# EAGLE design schem (EAGLE 6.5.0)
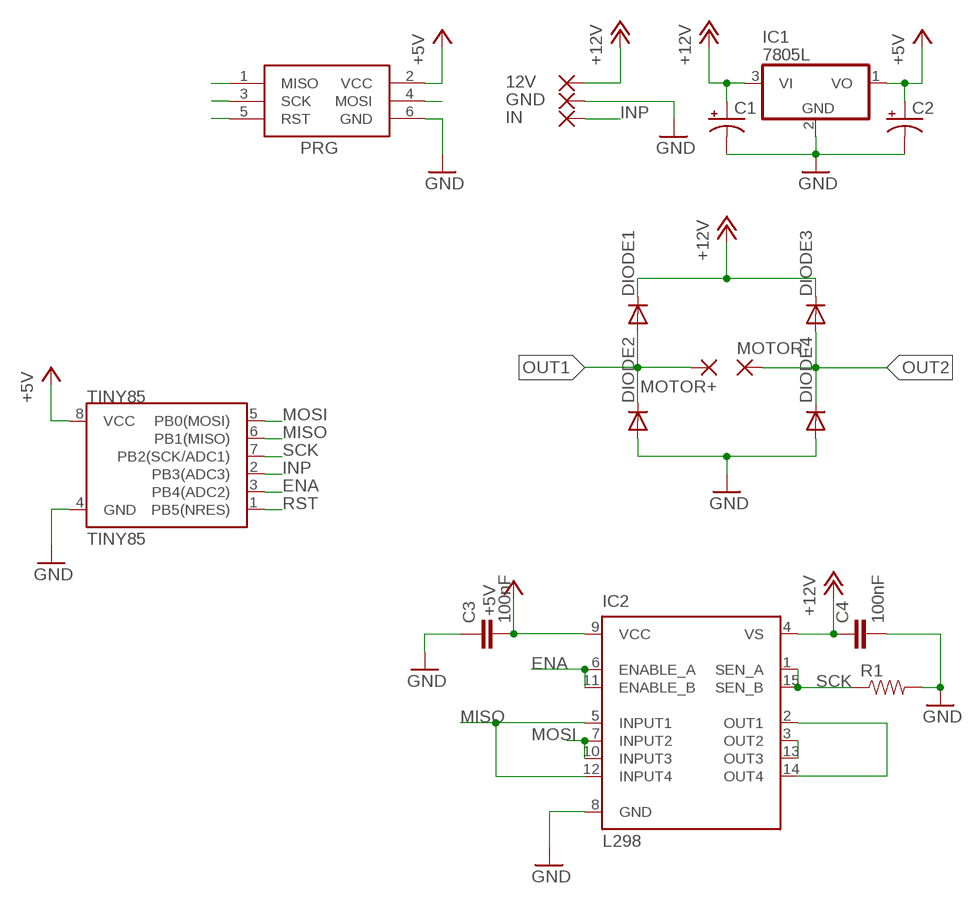
[diagram p0: schematic, sheet 1]

## Parts
12V  3,81/1,4  [3,81/1,4]
C1  CPOL-USE2.5-6  [E2,5-6]
C2  CPOL-USE2.5-6  [E2,5-6]
C3  100nF  CAPPTH2  [CAP-PTH-SMALL2]
C4  100nF  CAPPTH2  [CAP-PTH-SMALL2]
DIODE1  DIODE-DO41-7.6  [DO41-7.6]
DIODE2  DIODE-DO41-7.6  [DO41-7.6]
DIODE3  DIODE-DO41-7.6  [DO41-7.6]
DIODE4  DIODE-DO41-7.6  [DO41-7.6]
GND  3,81/1,4  [3,81/1,4]
IC1  7805L  [TO92]
IC2  L298  [MULTIWATT-15]
IN  1,6/0,9  [1,6/0,9]
MOTOR+  3,81/1,4  [3,81/1,4]
MOTOR-  3,81/1,4  [3,81/1,4]
PRG  AVRISP-6  [AVRISP]
R1  RESISTORPTH-1/4W  [AXIAL-0.4]
TINY85  TINY85  ATTINY45TINY85-20-DIP  [DIP08]

## Nets
+5V: C2.+ C3.2 IC1.1(VO) IC2.9(VCC) PRG.2(VCC) TINY85.8(VCC)
+12V: 12V.1(P) C1.+ C4.1 DIODE1.C DIODE3.C IC1.3(VI) IC2.4(VS)
ENA: IC2.6(ENABLE_A) IC2.11(ENABLE_B) TINY85.3(PB4(ADC2))
GND: C1.- C2.- C3.1 C4.2 DIODE2.A DIODE4.A GND.1(P) IC1.2(GND) IC2.8(GND) PRG.6(GND) R1.P$2 TINY85.4(GND)
INP: IN.1(P) TINY85.2(PB3(ADC3))
MISO: IC2.5(INPUT1) IC2.12(INPUT4) PRG.1(MISO) TINY85.6(PB1(MISO))
MOSI: IC2.7(INPUT2) IC2.10(INPUT3) PRG.4(MOSI) TINY85.5(PB0(MOSI))
OUT1: DIODE1.A DIODE2.C IC2.2(OUT1) IC2.14(OUT4) MOTOR+.1(P)
OUT2: DIODE3.A DIODE4.C IC2.3(OUT2) IC2.13(OUT3) MOTOR-.1(P)
RST: PRG.5(RST) TINY85.1(PB5(NRES))
SCK: IC2.1(SEN_A) IC2.15(SEN_B) PRG.3(SCK) R1.P$1 TINY85.7(PB2(SCK/ADC1))

## Library data of the parts
12V GND MOTOR+ MOTOR- = wirepad:3,81/1,4: THROUGH-HOLE PAD
C1 C2 = adafruit:CPOL-US: POLARIZED CAPACITOR, American symbol
C3 C4 = SparkFun-Capacitors:CAP: Capacitor Standard 0603 ceramic capacitor, and 0.1" leaded capacitor.
DIODE1-DIODE4 = diode:DIODE-: DIODE
IC1 = linear:78*: Positive VOLTAGE REGULATOR Source: http://cache.national.com/ds/LM/LM78L05.pdf http://www.fairchildsemi.com/ds/LM/LM7805.pdf
IC2 = st-microelectronics:L298: DUAL FULL-BRIDGE DRIVER; MPN: L298N; OC_FARNELL: 1589425; OC_NEWARK: 32M1527
IN = wirepad:1,6/0,9: THROUGH-HOLE PAD
PRG = adafruit:AVRISP: AVR ISP HEADER Standard 6 pin header for AVR programming
R1 = SparkFun-Passives:RESISTOR: Resistor Basic schematic elements and footprints for 0603, 1206, and PTH resistors.
TINY85 = SparkFun-DigitalIC:ATTINY45: Atmel 8-pin 2/4/8kB flash uC; PROD_ID: IC-09445; VALUE: TINY85-20-DIP

## Board
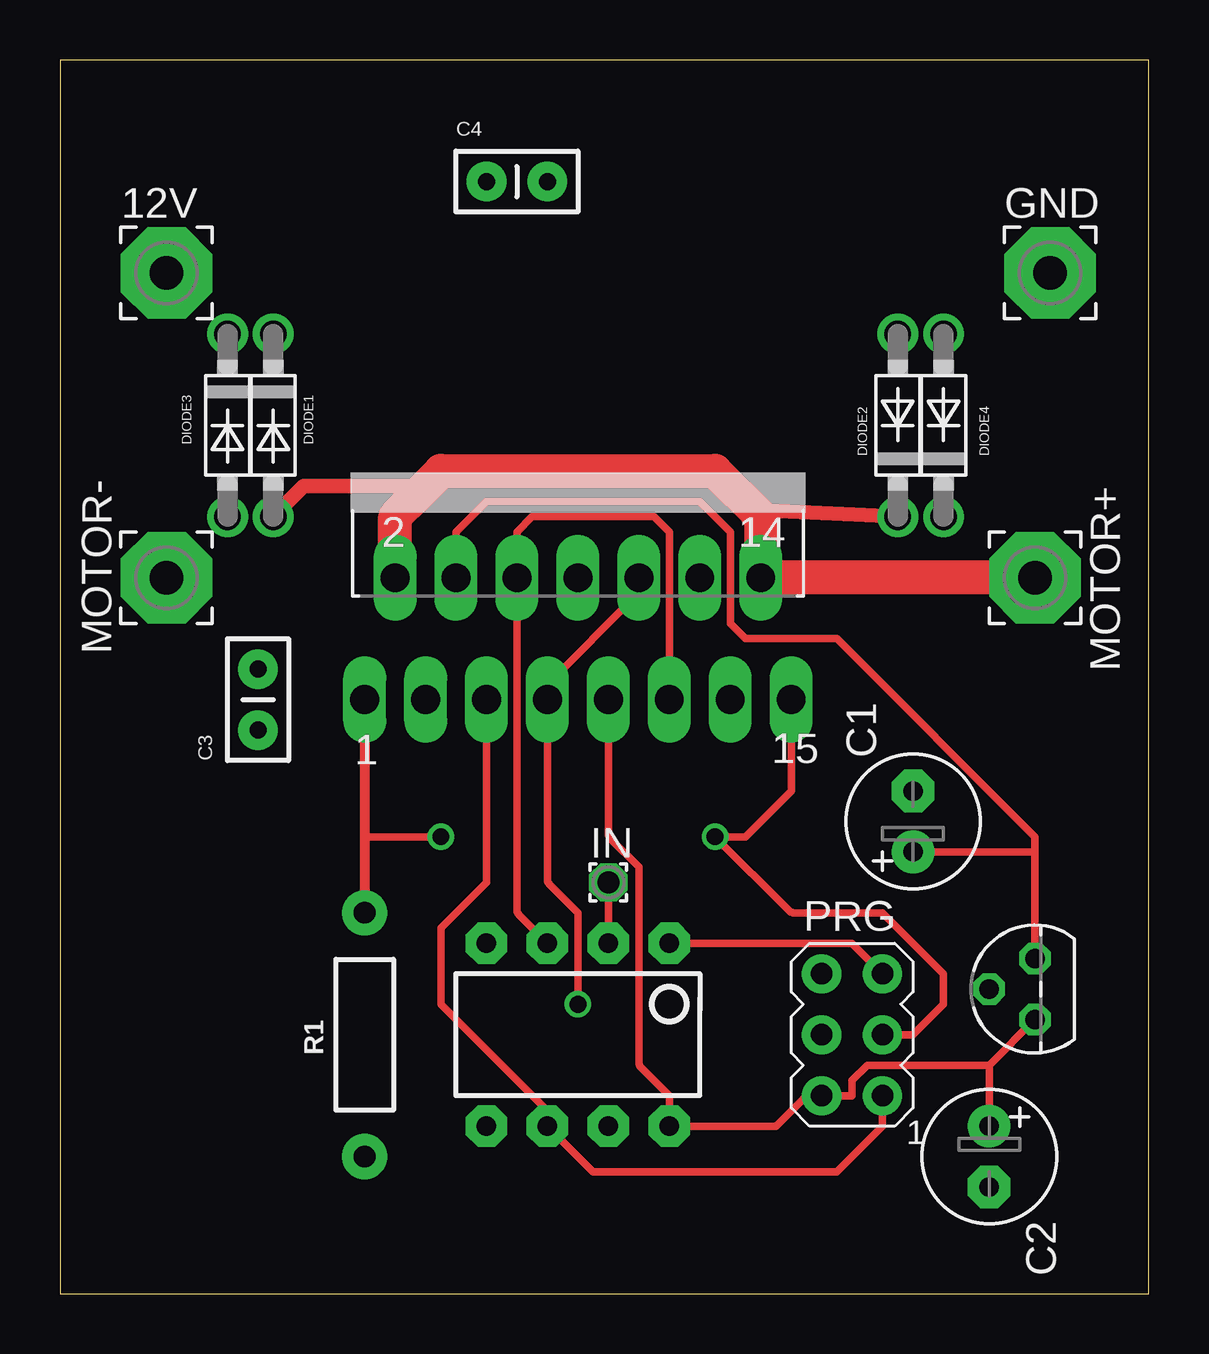
[diagram p1: board, top side]
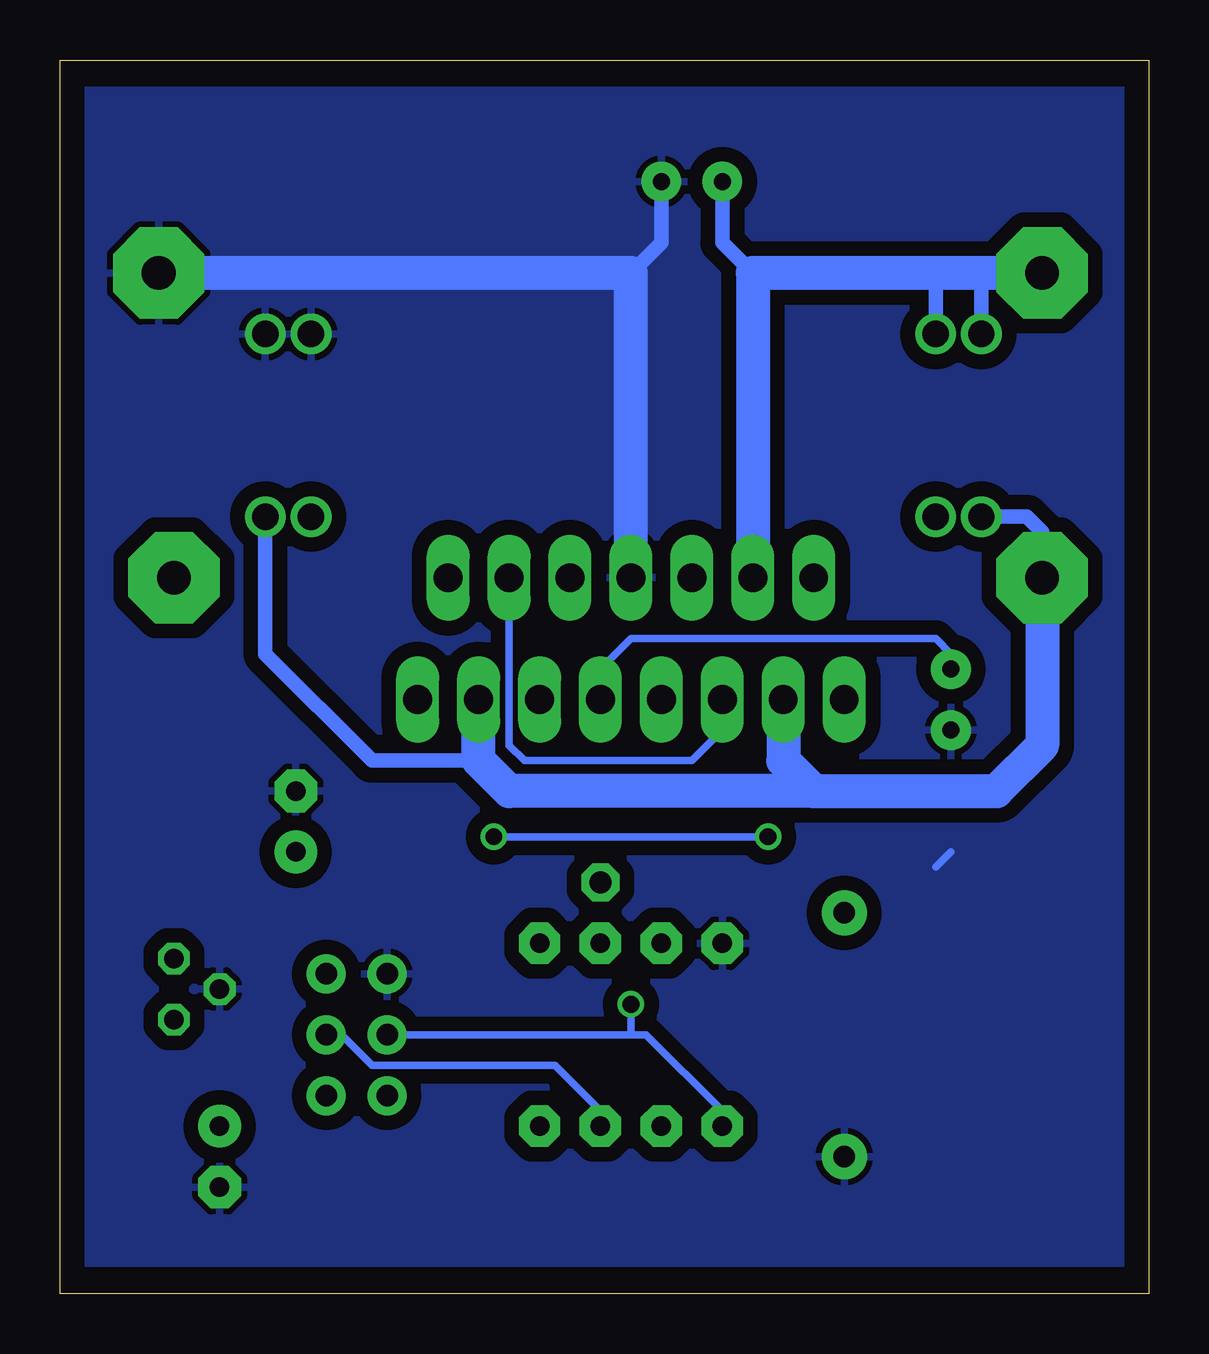
[diagram p2: board, bottom side, seen from below]

Size 45.39 x 51.42 mm. Coordinates in mm from the lower left corner, seen from the top.
Outline: 0,0 45.39,0 45.39,51.42 0,51.42 0,0
Copper layers (1*16): Top 0.035mm / dielectric 1.5mm / Bottom 0.035mm
Design rules "default": minimum track width 10mil, minimum drill 24mil, track to track 8mil, track to pad 8mil, pad to pad 8mil, via to via 8mil, smd to smd 8mil, copper to edge 40mil, drill to drill 8mil, minimum pad ring 10mil, minimum via ring 8mil, stop-mask expansion 4mil, vias tented up to drill 0mil, thermal gap 10mil

### Footprints (pad centres in the part's own frame; a part is rotated, then mirrored left to right if it is on the bottom)
3,81/1,4 = drill 1.397 pad 3.81 octagon: 1 0,0
E2,5-6 = drill 0.813 pad 1.778: + -1.27,0 | drill 0.813 pad 1.778 octagon: - 1.27,0
CAP-PTH-SMALL2 = drill 0.7 pad 1.651: 1 0,0; 2 2.54,0
DO41-7.6 = drill 1.1 pad 1.7: A 3.81,0; C -3.81,0
TO92 = drill 0.813 octagon: 1 -1.27,0; 2 0,1.905; 3 1.27,0
MULTIWATT-15 = drill 1.2 long: 1 -8.89,-7.62; 2 -7.62,-2.54; 3 -6.35,-7.62; 4 -5.08,-2.54; 5 -3.81,-7.62; 6 -2.54,-2.54; 7 -1.27,-7.62; 8 0,-2.54; 9 1.27,-7.62; 10 2.54,-2.54; 11 3.81,-7.62; 12 5.08,-2.54; 13 6.35,-7.62; 14 7.62,-2.54; 15 8.89,-7.62
1,6/0,9 = drill 0.914 pad 1.6 octagon: 1 0,0
AVRISP = drill 0.9 pad 1.626: 1 -1.27,2.54; 2 1.27,2.54; 3 -1.27,0; 4 1.27,0; 5 -1.27,-2.54; 6 1.27,-2.54
AXIAL-0.4 = drill 0.9 pad 1.88: P$1 -5.08,0; P$2 5.08,0
DIP08 = drill 0.813 pad 1.727 octagon: 1 -3.81,-3.81; 2 -1.27,-3.81; 3 1.27,-3.81; 4 3.81,-3.81; 5 3.81,3.81; 6 1.27,3.81; 7 -1.27,3.81; 8 -3.81,3.81

### Placement (x,y rotation side)
12V  4.45,42.55 0 top
C1  35.56,19.68 90 top
C2  38.73,5.71 270 top
C3  8.26,23.5 90 top
C4  17.78,46.35 0 top
DIODE1  8.89,36.2 270 top
DIODE2  34.92,36.2 90 top
DIODE3  6.99,36.2 270 top
DIODE4  36.83,36.2 90 top
GND  41.27,42.55 0 top
IC1  40.64,12.7 90 top
IC2  21.59,32.38 0 top
IN  22.86,17.14 0 top
MOTOR+  40.64,29.84 0 top
MOTOR-  4.45,29.84 0 top
PRG  33.02,10.79 180 top
R1  12.7,10.79 270 top
TINY85  21.59,10.79 180 top

### Tracks (layer width: path | path; a pad name or v marks a point on that pad's centre or on a via)
+5V
  Top 0.305: 38.73,9.53 33.66,9.53 33.02,8.89 33.02,8.26 PRG.2 31.11,8.26 29.84,6.99 TINY85.8 25.4,8.26 24.22,9.43 arc-45 24.13,9.66 24.13,17.78 22.95,18.96 arc-45 22.86,19.18 IC2.9 | 38.73,9.53 IC1.1 | C2.+ 38.73,9.53
  Bottom 0.305: IC2.9 22.86,26.04 21.59,27.3 8.89,27.3 8.26,26.67 C3.2
+12V
  Top 0.305: IC2.4 16.51,31.75 17.78,33.02 26.67,33.02 27.94,31.75 27.94,27.94 28.57,27.3 32.38,27.3 40.64,19.05 40.64,18.41 | 40.64,18.41 IC1.3 | C1.+ 40.64,18.41
  Bottom 0.61: C4.1 17.78,43.81 16.51,42.55 | DIODE3.C 6.99,42.55 | DIODE1.C 8.89,42.55
  Bottom 1.422: 12V.1 6.99,42.55 8.89,42.55 16.51,42.55 IC2.4
ENA
  Top 0.305: IC2.11 25.4,31.75 24.77,32.38 19.68,32.38 19.05,31.75 IC2.6 19.05,16.01 arc45 19.14,15.78 TINY85.3
GND
  Bottom 0.305: 8.26,18.41 8.89,17.78
  Bottom 0.61: C4.2 20.32,43.81 21.59,42.55
  Bottom 1.422: IC2.8 21.59,42.55 GND.1
  pour Bottom (isolate 0.61): 0.64,50.16 44.45,50.16 44.45,1.27 0.64,1.27
INP
  Top 0.305: IN.1 TINY85.2
MISO
  Top 0.305: PRG.1 34.29,6.99 32.38,5.08 22.23,5.08 TINY85.6 20.32,7.62 15.88,12.06 15.88,15.24 17.78,17.14 IC2.5
  Bottom 0.305: IC2.12 26.67,22.86 26.04,22.23 19.05,22.23 17.78,23.5 IC2.5
MOSI  (via drill 0.7 pad 0.81)
  Top 0.305: IC2.10 24.13,29.34 arc-45 24.04,29.12 20.32,25.4 IC2.7 20.32,17.28 arc45 20.41,17.05 21.59,15.88 v21.59,12.06
  Bottom 0.305: PRG.4 21.59,10.79 | 21.59,10.79 20.95,10.79 17.78,7.62 TINY85.5 | v21.59,12.06 21.59,10.79
OUT1
  Top 0.61: 13.72,32.64 13.97,32.38 | DIODE2.C 29.46,32.64 29.21,32.38 | DIODE1.A 10.16,33.66 14.61,33.66 14.92,33.34
  Top 1.422: MOTOR+.1 IC2.14 29.21,32.38 27.3,34.29 15.88,34.29 14.92,33.34 13.97,32.38 IC2.2
OUT2
  Bottom 0.61: DIODE4.C 36.83,26.67 32.38,22.23 27.94,22.23 | DIODE3.A 5.08,32.38 4.45,31.75 MOTOR-.1
  Bottom 1.422: IC2.3 15.24,22.23 13.97,20.95 | 13.97,20.95 6.35,20.95 4.45,22.86 MOTOR-.1 | 13.97,20.95 26.67,20.95 27.94,22.23 IC2.13
RST
  Top 0.305: TINY85.1 33.02,14.61 PRG.5
SCK  (via drill 0.7)
  Top 0.305: PRG.3 35.56,10.79 36.83,12.06 36.83,13.34 34.29,15.88 30.61,15.88 arc-45 30.39,15.97 v27.3,19.05 28.57,19.05 30.48,20.95 IC2.15 | v15.88,19.05 12.7,19.05
  Top 0.406: IC2.1 12.7,19.05 R1.P$1
  Bottom 0.305: PRG.3 33.66,10.79 32.38,9.53 24.77,9.53 22.86,7.62 TINY85.7 | v27.3,19.05 v15.88,19.05